# Altium schematic sheet MCU_64.SchDoc: MCU
size A4; DocumentNumber: MB1136; Revision: C.3; SheetNumber: 2; SheetTotal: 4; Project: NUCLEO-XXXXRX
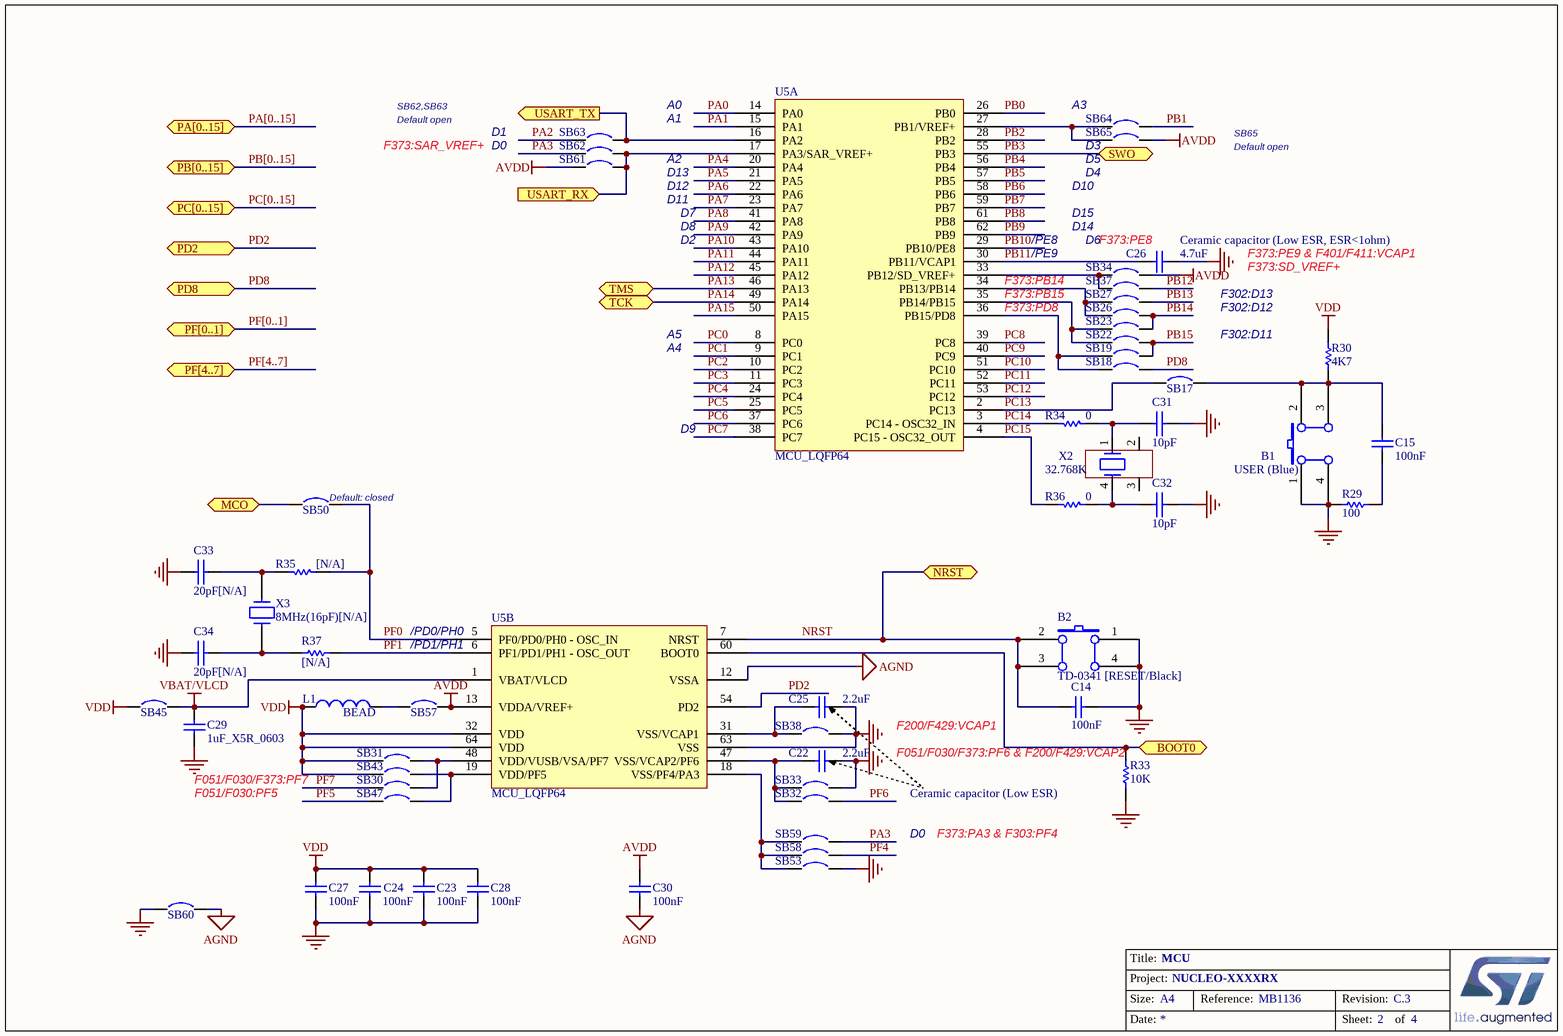
[diagram p0: MCU_64.SchDoc]

## Parts
B1  USER (Blue)  [PB10]
B2  TD-0341 [RESET/Black]  [PB10]
C14  100nF  [0603C]
C15  100nF  [0603C]
C22  2.2uF  [TAN-A]
C23  100nF  [0603C]
C24  100nF  [0603C]
C25  2.2uF  [TAN-A]
C26  4.7uF  [TAN-A]
C27  100nF  [0603C]
C28  100nF  [0603C]
C29  1uF_X5R_0603  [0603C]
C30  100nF  [0603C]
C31  10pF  [0603C]
C32  10pF  [0603C]
C33  20pF[N/A]  [0603C]
C34  20pF[N/A]  [0603C]
L1  BEAD  [0603L]
R29  100  [0603R]
R30  4K7  [0603R]
R33  10K  [0603R]
R34  0  [0603R]
R35  [N/A]  [0603R]
R36  0  [0603R]
R37  [N/A]  [0603R]
SB17  Circuit Breaker  [JP2_SMD]  (value not drawn)
SB18  Circuit Breaker  [JP2_SMD]  (value not drawn)
SB19  Circuit Breaker  [JP2_SMD]  (value not drawn)
SB22  Circuit Breaker  [JP2_SMD]  (value not drawn)
SB23  Circuit Breaker  [JP2_SMD]  (value not drawn)
SB26  Circuit Breaker  [JP2_SMD]  (value not drawn)
SB27  Circuit Breaker  [JP2_SMD]  (value not drawn)
SB30  Circuit Breaker  [JP2_SMD]  (value not drawn)
SB31  Circuit Breaker  [JP2_SMD]  (value not drawn)
SB32  Circuit Breaker  [JP2_SMD]  (value not drawn)
SB33  Circuit Breaker  [JP2_SMD]  (value not drawn)
SB34  Circuit Breaker  [JP2_SMD]  (value not drawn)
SB37  Circuit Breaker  [JP2_SMD]  (value not drawn)
SB38  Circuit Breaker  [JP2_SMD]  (value not drawn)
SB43  Circuit Breaker  [JP2_SMD]  (value not drawn)
SB45  Circuit Breaker  [JP2_SMD]  (value not drawn)
SB47  Circuit Breaker  [JP2_SMD]  (value not drawn)
SB50  Circuit Breaker  [JP2_SMD]  (value not drawn)
SB53  Circuit Breaker  [JP2_SMD]  (value not drawn)
SB57  Circuit Breaker  [JP2_SMD]  (value not drawn)
SB58  Circuit Breaker  [JP2_SMD]  (value not drawn)
SB59  Circuit Breaker  [JP2_SMD]  (value not drawn)
SB60  Circuit Breaker  [JP2_SMD]  (value not drawn)
SB61  Circuit Breaker  [JP2_SMD]  (value not drawn)
SB62  Circuit Breaker  [JP2_SMD]  (value not drawn)
SB63  Circuit Breaker  [JP2_SMD]  (value not drawn)
SB64  Circuit Breaker  [JP2_SMD]  (value not drawn)
SB65  Circuit Breaker  [JP2_SMD]  (value not drawn)
U5  MCU_LQFP64  [LQFP64]  (parts A,B of 2)
X2  32.768K  [XTAL_4SM_8X3R8]
X3  8MHz(16pF)[N/A]  [XTAL1]

## Ports
BOOT0, MCO, NRST, PA[0..15] (bidir), PB[0..15] (bidir), PC[0..15] (bidir), PD2, PD8, PF[0..1] (bidir), PF[4..7] (bidir), SWO, TCK, TMS, USART_RX (in), USART_TX (out)

## Nets
AGND: C30.2 SB60.2 U5.12(VSSA)
AVDD: C30.1 SB34.2 SB57.2 SB61.1 SB65.2 U5.13(VDDA/VREF+)
GND: B1.1(A0) B1.4(A1) B2.1(A0) B2.4(A1) C14.1 C22.2 C23.2 C24.2 C25.2 C26.2 C27.2 C28.2 C29.2 C31.2 C32.2 C33.2 C34.2 R29.1 R33.2 SB33.2 SB38.2 SB53.2 SB60.1 U5.63(VSS)
VBAT/VLCD: C29.1 SB45.2 U5.1(VBAT/VLCD)
VDD: C23.1 C24.1 C27.1 C28.1 L1.1 R30.2 SB31.1 SB43.1 SB45.1 U5.32(VDD) U5.64(VDD)
BOOT0: R33.1 U5.60(BOOT0) ; port BOOT0
MCO: SB50.1 ; port MCO
NRST: B2.2(B0) B2.3(B1) C14.2 U5.7(NRST) ; port NRST
PA0: U5.14(PA0)
PA1: U5.15(PA1)
PA2: SB63.1
PA3: SB59.2 SB62.1
PA4: U5.20(PA4)
PA5: U5.21(PA5)
PA6: U5.22(PA6)
PA7: U5.23(PA7)
PA8: U5.41(PA8)
PA9: U5.42(PA9)
PA10: U5.43(PA10)
PA11: U5.44(PA11)
PA12: U5.45(PA12)
PA13: U5.46(PA13) ; port TMS
PA14: U5.49(PA14) ; port TCK
PA15: U5.50(PA15)
PB0: U5.26(PB0)
PB1: SB64.2
PB2: U5.28(PB2)
PB3: U5.55(PB3) ; port SWO
PB4: U5.56(PB4)
PB5: U5.57(PB5)
PB6: U5.58(PB6)
PB7: U5.59(PB7)
PB8: U5.61(PB8)
PB9: U5.62(PB9)
PB10: U5.29(PB10/PE8)
PB11: C26.1 U5.30(PB11/VCAP1)
PB12: SB37.2
PB13: SB27.2
PB14: SB23.2 SB26.2
PB15: SB19.2 SB22.2
PC0: U5.8(PC0)
PC1: U5.9(PC1)
PC2: U5.10(PC2)
PC3: U5.11(PC3)
PC4: U5.24(PC4)
PC5: U5.25(PC5)
PC6: U5.37(PC6)
PC7: U5.38(PC7)
PC8: U5.39(PC8)
PC9: U5.40(PC9)
PC10: U5.51(PC10)
PC11: U5.52(PC11)
PC12: U5.53(PC12)
PC13: SB17.1 U5.2(PC13)
PC14: R34.2 U5.3(PC14_-_OSC32_IN)
PC15: R36.2 U5.4(PC15_-_OSC32_OUT)
PD2: U5.54(PD2) ; port PD2
PD8: SB18.2 ; port PD8
PF0: R35.1 SB50.2 U5.5(PF0/PD0/PH0_-_OSC_IN)
PF1: R37.1 U5.6(PF1/PD1/PH1_-_OSC_OUT)
PF4: SB58.2
PF5: SB47.1
PF6: SB32.2
PF7: SB30.1
USART_RX: SB61.2 SB62.2 U5.17(PA3/SAR_VREF+) ; port USART_RX
USART_TX: SB63.2 U5.16(PA2) ; port USART_TX
NetB1_2: B1.2(B0) B1.3(B1) C15.2 R30.1 SB17.2
NetC15_1: C15.1 R29.2
NetC22_1: C22.1 SB32.1 SB33.1 U5.47(VSS/VCAP2/PF6)
NetC25_1: C25.1 SB38.1 U5.31(VSS/VCAP1)
NetC31_1: C31.1 R34.1 X2.1
NetC32_1: C32.1 R36.1 X2.4
NetC33_1: C33.1 R35.2 X3.2
NetC34_1: C34.1 R37.2 X3.1
NetL1_2: L1.2 SB57.1
NetSB18_1: SB18.1 SB19.1 U5.36(PB15/PD8)
NetSB22_1: SB22.1 SB23.1 U5.35(PB14/PB15)
NetSB26_1: SB26.1 SB27.1 U5.34(PB13/PB14)
NetSB30_2: SB30.2 SB31.2 U5.48(VDD/VUSB/VSA/PF7)
NetSB34_1: SB34.1 SB37.1 U5.33(PB12/SD_VREF+)
NetSB43_2: SB43.2 SB47.2 U5.19(VDD/PF5)
NetSB53_1: SB53.1 SB58.1 SB59.1 U5.18(VSS/PF4/PA3)
NetSB64_1: SB64.1 SB65.1 U5.27(PB1/VREF+)

Not connected (* = marked no-connect by the designer): X2 2 3

## Buses and harness runs
bus PA[0..15] = port PA[0..15]
bus PB[0..15] = port PB[0..15]
bus PC[0..15] = port PC[0..15]
bus PF[0..1] = port PF[0..1]
bus PF[4..7] = port PF[4..7]

## Notes on the sheet
- SB62,SB63
- A0
- A3
- F373:SAR_VREF+
- Default open
- D0
- D1
- A1
- A2
- D13
- D4
- D3
- D5
- SB65
- D12
- D11
- D2
- D7
- D8
- /PE8
- D14
- D15
- D10
- D6
- (near C26) F373:PE8
- (near C26) Ceramic capacitor (Low ESR, ESR<1ohm)
- F373:PB14
- F373:PB15
- F373:PD8
- /PE9
- F302:D12
- F302:D13
- F373:PE9 & F401/F411:VCAP1
- F373:SD_VREF+
- A4
- A5
- F302:D11
- D9
- (near SB50) Default: closed
- (near U5) /PD0/PH0
- (near U5) /PD1/PH1
- (near C29) F051/F030/F373:PF7
- F200/F429:VCAP1
- (near R33) F051/F030/F373:PF6 & F200/F429:VCAP2
- F051/F030:PF5
- Ceramic capacitor (Low ESR)
- F373:PA3 & F303:PF4
- Title:
- Project:
- Size:
- Date:
- Reference:
- Sheet:
- Revision:
- of

## Library data of the parts
B1 B2 = SW PUSHBUTTON: SE PUSHBUTTON
C14 C15 = CAP: Capacitor; Value: 100pF; Published: 8-Jun-2000; Revision: July-2002: Re-released for DXP Platform.; Publisher: Altium Limited
C22 C25 = Cap_2.2uF_X7R_10%_0805: Capacitor,2.2uF,16V, X7R,10%,0805,YAGEO; Manuf_Part_1: CC0805KKX7R7BB225; Revision: July-2002: Re-released for DXP Platform.; Value: 2.2uF; Order: CC0805KKX7R7BB225; Manuf_1: YAGEO
C23 C24 C27 C28 C30 = Cap: Capacitor; Value: 10nF; Published: 8-Jun-2000; Revision: July-2002: Re-released for DXP Platform.; Publisher: Altium Limited
C26 = Cap_2.2uF_X7R_10%_0805: Capacitor,4.7uF,25V, X7R,10%,1206,YAGEO; Manuf_Part_1: CC0805KKX7R7BB225; Value: 2.2uF; Description: Capacitor,2.2uF,16V, X7R,10%,0805,YAGEO; Revision: July-2002: Re-released for DXP Platform.; Order: CC0805KKX7R7BB225; Manuf_1: YAGEO
C29 = CAP SMD 0603  X5R 1µF 25V 10%: 0603  X5R 1µF; Rated voltage: 25V; Tolerance: 10%; Manufacturer: *; Manufacturer P/N: *; Order code Farnell: 1288202RL; Value: 1µF; Power: *; Technology: X5R; Temperature  Factor: *; Temperature Max: +125°C; Temperature Min: -55°C; STS Code: *
C31-C34 = CAP: Capacitor
L1 = Inductor: Value: 100uH; Published: 8-Jun-2000; Revision: July-2002: Re-released for DXP Platform.; Publisher: Altium Limited
R29 R34-R37 = Res1: Resistor; Value: 1K; Published: 8-Jun-2000; Revision: July-2002: Re-released for DXP Platform.; Publisher: Altium Limited
R30 R33 = res1: Resistor; Value: 1K; Published: 8-Jun-2000; Revision: July-2002: Re-released for DXP Platform.; Publisher: Altium Limited
SB17-SB19 SB22 SB23 SB26 SB27 SB30-SB34 SB37 SB38 SB43 SB45 SB47 SB50 SB53 SB57-SB65 = Circuit Breaker: Solder: NO; Published: 24-Mar-1999; Revision: July-2002: Re-released for DXP Platform.; Publisher: Altium Limited
X2 = MC306
X3 = CRYSTAL